# Altium schematic sheet [1]- Schematic Block.SchDoc
size A4; DocumentNumber: 1; SheetNumber: 1; SheetTotal: 11
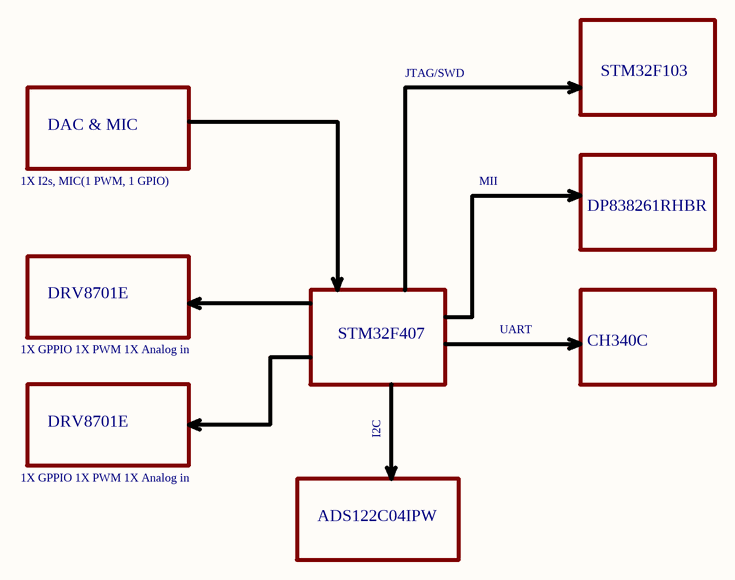
[diagram p0: [1]- Schematic Block.SchDoc]

## Notes on the sheet
- DAC & MIC
- JTAG/SWD
- STM32F103
- 1X I2s, MIC(1 PWM, 1 GPIO)
- MII
- DP838261RHBR
- DRV8701E
- STM32F407
- UART
- 1X GPPIO 1X PWM 1X Analog in
- CH340C
- I2C
- ADS122C04IPW